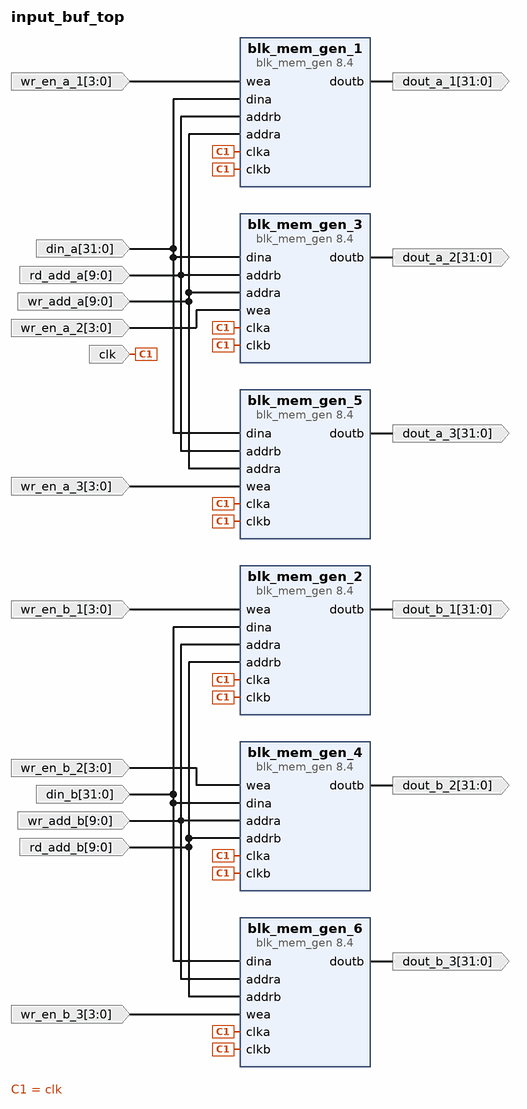
[diagram p0: block diagram of the top level]
# Vivado block design input_buf_top, xc7z020clg484-1, Vivado 2018.2
create_bd_design input_buf_top

create_bd_port -dir I -from 31 -to 0 din_a
create_bd_port -dir I -from 9 -to 0 rd_add_a
create_bd_port -dir I -from 3 -to 0 wr_en_a_1
create_bd_port -dir I -from 9 -to 0 wr_add_a
create_bd_port -dir I -from 3 -to 0 wr_en_b_1
create_bd_port -dir I -type clk clk
create_bd_port -dir O -from 31 -to 0 dout_a_1
create_bd_port -dir I -from 31 -to 0 din_b
create_bd_port -dir I -from 9 -to 0 wr_add_b
create_bd_port -dir I -from 9 -to 0 rd_add_b
create_bd_port -dir O -from 31 -to 0 dout_b_1
create_bd_port -dir I -from 3 -to 0 wr_en_a_2
create_bd_port -dir I -from 3 -to 0 wr_en_a_3
create_bd_port -dir I -from 3 -to 0 wr_en_b_2
create_bd_port -dir I -from 3 -to 0 wr_en_b_3
create_bd_port -dir O -from 31 -to 0 dout_a_2
create_bd_port -dir O -from 31 -to 0 dout_a_3
create_bd_port -dir O -from 31 -to 0 dout_b_2
create_bd_port -dir O -from 31 -to 0 dout_b_3

create_bd_cell -type ip -vlnv xilinx.com:ip:blk_mem_gen:8.4 blk_mem_gen_1
set_property -dict [list \
  CONFIG.Memory_Type Simple_Dual_Port_RAM \
  CONFIG.Enable_32bit_Address false \
  CONFIG.Use_Byte_Write_Enable true \
  CONFIG.Byte_Size 8 \
  CONFIG.Assume_Synchronous_Clk false \
  CONFIG.Write_Width_A 32 \
  CONFIG.Write_Depth_A 721 \
  CONFIG.Operating_Mode_A WRITE_FIRST \
  CONFIG.Enable_A Always_Enabled \
  CONFIG.Write_Width_B 32 \
  CONFIG.Read_Width_B 32 \
  CONFIG.Enable_B Always_Enabled \
  CONFIG.Register_PortB_Output_of_Memory_Primitives false \
  CONFIG.Use_RSTB_Pin false \
  CONFIG.Port_B_Clock 100 \
  CONFIG.Port_B_Enable_Rate 100 \
  CONFIG.use_bram_block Stand_Alone \
] [get_bd_cells blk_mem_gen_1]
create_bd_cell -type ip -vlnv xilinx.com:ip:blk_mem_gen:8.4 blk_mem_gen_2
set_property -dict [list \
  CONFIG.Memory_Type Simple_Dual_Port_RAM \
  CONFIG.Enable_32bit_Address false \
  CONFIG.Use_Byte_Write_Enable true \
  CONFIG.Byte_Size 8 \
  CONFIG.Assume_Synchronous_Clk false \
  CONFIG.Write_Width_A 32 \
  CONFIG.Write_Depth_A 721 \
  CONFIG.Operating_Mode_A WRITE_FIRST \
  CONFIG.Enable_A Always_Enabled \
  CONFIG.Write_Width_B 32 \
  CONFIG.Read_Width_B 32 \
  CONFIG.Enable_B Always_Enabled \
  CONFIG.Register_PortB_Output_of_Memory_Primitives false \
  CONFIG.Use_RSTB_Pin false \
  CONFIG.Port_B_Clock 100 \
  CONFIG.Port_B_Enable_Rate 100 \
  CONFIG.use_bram_block Stand_Alone \
] [get_bd_cells blk_mem_gen_2]
create_bd_cell -type ip -vlnv xilinx.com:ip:blk_mem_gen:8.4 blk_mem_gen_3
set_property -dict [list \
  CONFIG.Memory_Type Simple_Dual_Port_RAM \
  CONFIG.Enable_32bit_Address false \
  CONFIG.Use_Byte_Write_Enable true \
  CONFIG.Byte_Size 8 \
  CONFIG.Assume_Synchronous_Clk false \
  CONFIG.Write_Width_A 32 \
  CONFIG.Write_Depth_A 721 \
  CONFIG.Operating_Mode_A WRITE_FIRST \
  CONFIG.Enable_A Always_Enabled \
  CONFIG.Write_Width_B 32 \
  CONFIG.Read_Width_B 32 \
  CONFIG.Enable_B Always_Enabled \
  CONFIG.Register_PortB_Output_of_Memory_Primitives false \
  CONFIG.Use_RSTB_Pin false \
  CONFIG.Port_B_Clock 100 \
  CONFIG.Port_B_Enable_Rate 100 \
  CONFIG.use_bram_block Stand_Alone \
] [get_bd_cells blk_mem_gen_3]
create_bd_cell -type ip -vlnv xilinx.com:ip:blk_mem_gen:8.4 blk_mem_gen_4
set_property -dict [list \
  CONFIG.Memory_Type Simple_Dual_Port_RAM \
  CONFIG.Enable_32bit_Address false \
  CONFIG.Use_Byte_Write_Enable true \
  CONFIG.Byte_Size 8 \
  CONFIG.Assume_Synchronous_Clk false \
  CONFIG.Write_Width_A 32 \
  CONFIG.Write_Depth_A 721 \
  CONFIG.Operating_Mode_A WRITE_FIRST \
  CONFIG.Enable_A Always_Enabled \
  CONFIG.Write_Width_B 32 \
  CONFIG.Read_Width_B 32 \
  CONFIG.Enable_B Always_Enabled \
  CONFIG.Register_PortB_Output_of_Memory_Primitives false \
  CONFIG.Use_RSTB_Pin false \
  CONFIG.Port_B_Clock 100 \
  CONFIG.Port_B_Enable_Rate 100 \
  CONFIG.use_bram_block Stand_Alone \
] [get_bd_cells blk_mem_gen_4]
create_bd_cell -type ip -vlnv xilinx.com:ip:blk_mem_gen:8.4 blk_mem_gen_5
set_property -dict [list \
  CONFIG.Memory_Type Simple_Dual_Port_RAM \
  CONFIG.Enable_32bit_Address false \
  CONFIG.Use_Byte_Write_Enable true \
  CONFIG.Byte_Size 8 \
  CONFIG.Assume_Synchronous_Clk false \
  CONFIG.Write_Width_A 32 \
  CONFIG.Write_Depth_A 721 \
  CONFIG.Operating_Mode_A WRITE_FIRST \
  CONFIG.Enable_A Always_Enabled \
  CONFIG.Write_Width_B 32 \
  CONFIG.Read_Width_B 32 \
  CONFIG.Enable_B Always_Enabled \
  CONFIG.Register_PortB_Output_of_Memory_Primitives false \
  CONFIG.Use_RSTB_Pin false \
  CONFIG.Port_B_Clock 100 \
  CONFIG.Port_B_Enable_Rate 100 \
  CONFIG.use_bram_block Stand_Alone \
] [get_bd_cells blk_mem_gen_5]
create_bd_cell -type ip -vlnv xilinx.com:ip:blk_mem_gen:8.4 blk_mem_gen_6
set_property -dict [list \
  CONFIG.Memory_Type Simple_Dual_Port_RAM \
  CONFIG.Enable_32bit_Address false \
  CONFIG.Use_Byte_Write_Enable true \
  CONFIG.Byte_Size 8 \
  CONFIG.Assume_Synchronous_Clk false \
  CONFIG.Write_Width_A 32 \
  CONFIG.Write_Depth_A 721 \
  CONFIG.Operating_Mode_A WRITE_FIRST \
  CONFIG.Enable_A Always_Enabled \
  CONFIG.Write_Width_B 32 \
  CONFIG.Read_Width_B 32 \
  CONFIG.Enable_B Always_Enabled \
  CONFIG.Register_PortB_Output_of_Memory_Primitives false \
  CONFIG.Use_RSTB_Pin false \
  CONFIG.Port_B_Clock 100 \
  CONFIG.Port_B_Enable_Rate 100 \
  CONFIG.use_bram_block Stand_Alone \
] [get_bd_cells blk_mem_gen_6]

# ---- connections ----

connect_bd_net [get_bd_ports din_a] [get_bd_pins blk_mem_gen_1/dina] [get_bd_pins blk_mem_gen_3/dina] [get_bd_pins blk_mem_gen_5/dina]
connect_bd_net [get_bd_ports rd_add_a] [get_bd_pins blk_mem_gen_1/addrb] [get_bd_pins blk_mem_gen_5/addrb] [get_bd_pins blk_mem_gen_3/addrb]
connect_bd_net -net wea_0_1 [get_bd_ports wr_en_a_1] [get_bd_pins blk_mem_gen_1/wea]
connect_bd_net -net wr_add [get_bd_ports wr_add_a] \
  [get_bd_pins blk_mem_gen_1/addra] [get_bd_pins blk_mem_gen_5/addra] [get_bd_pins blk_mem_gen_3/addra]
connect_bd_net -net wea_1_1 [get_bd_ports wr_en_b_1] [get_bd_pins blk_mem_gen_2/wea]
connect_bd_net -net clka_0_1 [get_bd_ports clk] \
  [get_bd_pins blk_mem_gen_1/clka] [get_bd_pins blk_mem_gen_6/clkb] [get_bd_pins blk_mem_gen_6/clka] \
  [get_bd_pins blk_mem_gen_1/clkb] [get_bd_pins blk_mem_gen_3/clka] [get_bd_pins blk_mem_gen_3/clkb] \
  [get_bd_pins blk_mem_gen_5/clka] [get_bd_pins blk_mem_gen_5/clkb] [get_bd_pins blk_mem_gen_4/clkb] \
  [get_bd_pins blk_mem_gen_4/clka] [get_bd_pins blk_mem_gen_2/clkb] [get_bd_pins blk_mem_gen_2/clka]
connect_bd_net [get_bd_pins blk_mem_gen_1/doutb] [get_bd_ports dout_a_1]
connect_bd_net -net dina_0_1 [get_bd_ports din_b] [get_bd_pins blk_mem_gen_2/dina] [get_bd_pins blk_mem_gen_6/dina] [get_bd_pins blk_mem_gen_4/dina]
connect_bd_net -net addra_0_1 [get_bd_ports wr_add_b] \
  [get_bd_pins blk_mem_gen_6/addra] [get_bd_pins blk_mem_gen_4/addra] [get_bd_pins blk_mem_gen_2/addra]
connect_bd_net [get_bd_ports rd_add_b] [get_bd_pins blk_mem_gen_2/addrb] [get_bd_pins blk_mem_gen_4/addrb] [get_bd_pins blk_mem_gen_6/addrb]
connect_bd_net [get_bd_pins blk_mem_gen_2/doutb] [get_bd_ports dout_b_1]
connect_bd_net -net wea_0_2 [get_bd_ports wr_en_a_2] [get_bd_pins blk_mem_gen_3/wea]
connect_bd_net -net wea_0_3 [get_bd_ports wr_en_a_3] [get_bd_pins blk_mem_gen_5/wea]
connect_bd_net -net wea_0_4 [get_bd_ports wr_en_b_2] [get_bd_pins blk_mem_gen_4/wea]
connect_bd_net -net wea_0_5 [get_bd_ports wr_en_b_3] [get_bd_pins blk_mem_gen_6/wea]
connect_bd_net [get_bd_pins blk_mem_gen_3/doutb] [get_bd_ports dout_a_2]
connect_bd_net [get_bd_pins blk_mem_gen_5/doutb] [get_bd_ports dout_a_3]
connect_bd_net [get_bd_pins blk_mem_gen_4/doutb] [get_bd_ports dout_b_2]
connect_bd_net [get_bd_pins blk_mem_gen_6/doutb] [get_bd_ports dout_b_3]

validate_bd_design
save_bd_design
